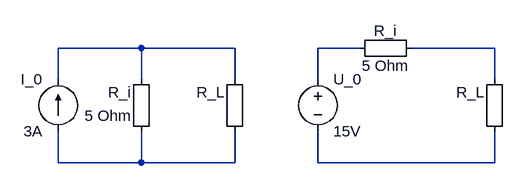
[diagram p0: schematic Schema.asc]
Schema.asc, the LTspice schematic file:
Version 4.1
SHEET 1 880 680
WIRE -240 96 -368 96
WIRE -96 96 -240 96
WIRE 96 96 32 96
WIRE 304 96 176 96
WIRE -368 144 -368 96
WIRE -240 144 -240 96
WIRE -96 144 -96 96
WIRE 32 144 32 96
WIRE 304 144 304 96
WIRE -368 272 -368 224
WIRE -240 272 -240 224
WIRE -240 272 -368 272
WIRE -96 272 -96 224
WIRE -96 272 -240 272
WIRE 32 272 32 224
WIRE 304 272 304 224
WIRE 304 272 32 272
SYMBOL voltage 32 128 R0
SYMATTR InstName U_0
SYMATTR Value 15V
SYMBOL Misc\\EuropeanResistor 192 80 R90
WINDOW 0 5 56 VBottom 2
WINDOW 3 27 56 VTop 2
SYMATTR InstName R_i
SYMATTR Value 5 Ohm
SYMBOL Misc\\EuropeanResistor 320 240 R180
WINDOW 0 31 76 Left 2
WINDOW 3 31 40 Left 2
SYMATTR InstName R_L
SYMATTR Value ""
SYMBOL Misc\\EuropeanResistor -224 240 R180
WINDOW 0 31 76 Left 2
WINDOW 3 31 40 Left 2
SYMATTR InstName R_i
SYMATTR Value 5 Ohm
SYMBOL Misc\\EuropeanResistor -80 240 R180
WINDOW 0 31 76 Left 2
WINDOW 3 31 40 Left 2
SYMATTR InstName R_L
SYMATTR Value ""
SYMBOL current -368 224 R180
WINDOW 0 24 80 Left 2
WINDOW 3 24 0 Left 2
WINDOW 123 0 0 Left 0
WINDOW 39 0 0 Left 0
SYMATTR InstName I_0
SYMATTR Value 3A

The netlist it stands for:
* Schema.asc
V§U_0 N002 N005 15V
R_i N003 N002 5 Ohm
R_L N005 N003
R_i N004 N001 5 Ohm
R_L N004 N001
I_0 N004 N001 3A
.backanno
.end